# EAGLE design IMU 9DoF AHRS (EAGLE 7.0.0)

## Sheet 1 of 2
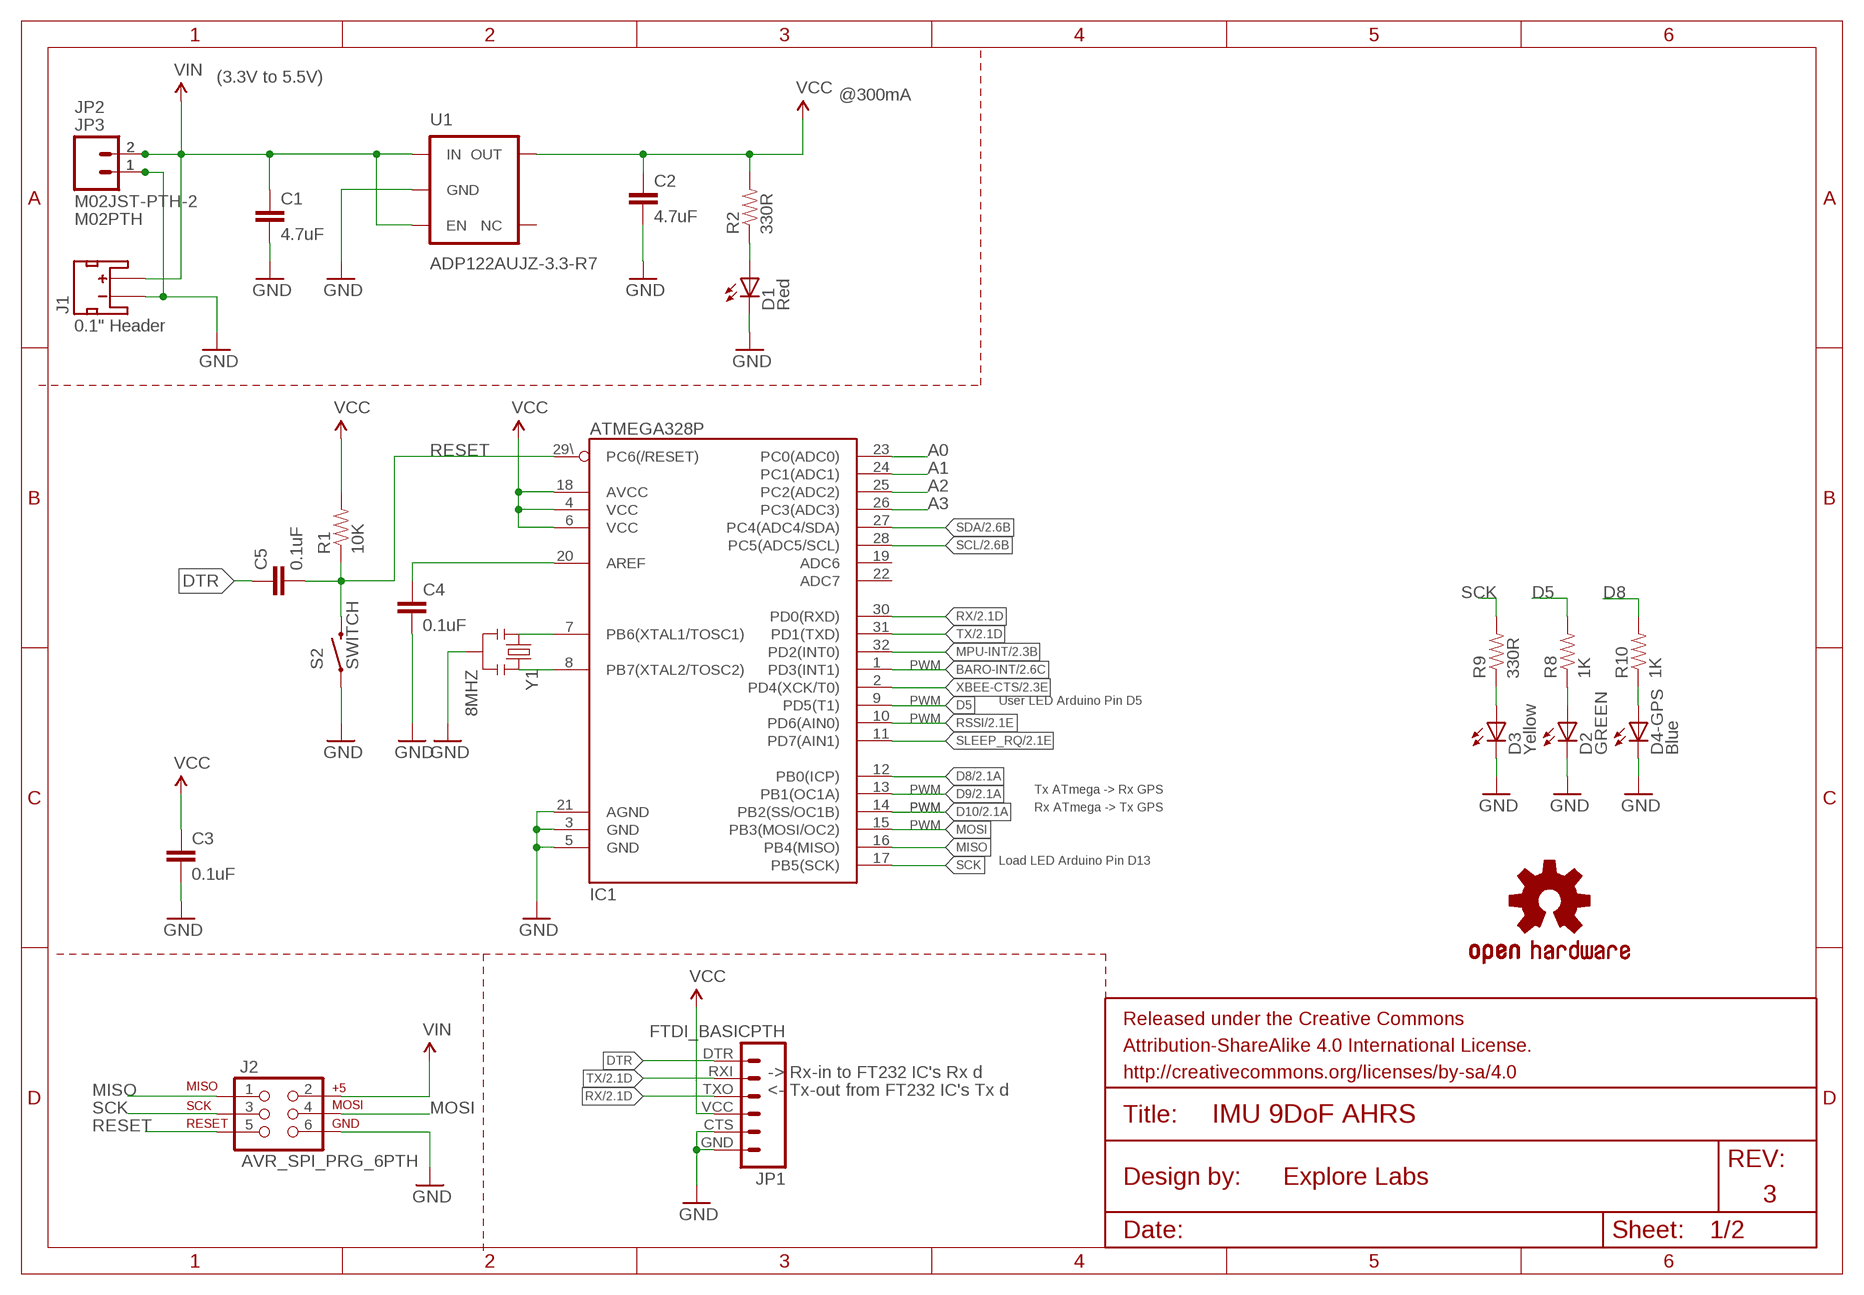
[diagram p0: schematic, sheet 1]

### Parts
C1  4.7uF  CAP0603-CAP  [0603-CAP]
C2  4.7uF  CAP0603-CAP  [0603-CAP]
C3  0.1uF  CAP0603-CAP  [0603-CAP]
C4  0.1uF  CAP0603-CAP  [0603-CAP]
C5  0.1uF  CAP0603-CAP  [0603-CAP]
D1  Red  LEDCHIPLED_0805  [CHIPLED_0805]
D2  GREEN  LEDCHIPLED_0805  [CHIPLED_0805]
D3  Yellow  LEDCHIPLED_0805  [CHIPLED_0805]
D4-GPS  Blue  LEDCHIPLED_0805  [CHIPLED_0805]
IC1  ATMEGA328P  ATMEGA328_SMT  [TQFP32-08]
J1  JST_2MM_MALE  [JST-2-SMD]
J2  AVR_SPI_PRG_6PTH  [2X3]
JP1  FTDI_BASICPTH  [FTDI_BASIC]
JP2  M02JST-PTH-2  [JST-2-PTH]
JP3  M02PTH  [1X02]
LOGO4  OSHW-LOGOBOTTOM  [OSHW-LOGO-M-BOTTOM]
R1  10K  RESISTOR0603-RES  [0603-RES]
R2  330R  RESISTOR0603-RES  [0603-RES]
R8  1K  RESISTOR0603-RES  [0603-RES]
R9  330R  RESISTOR0603-RES  [0603-RES]
R10  1K  RESISTOR0603-RES  [0603-RES]
S2  SWITCH-MOMENTARY-2-SMD-1101NE  [TACTILE-SWITCH-1101NE]
U1  ADP122AUJZ-3.3-R7  [SOT-23-5]
Y1  8MHZ  RESONATOR8MHZ  [RESONATOR-SMD]

### Nets
A0: IC1.23(PC0(ADC0))
A1: IC1.24(PC1(ADC1))
A2: IC1.25(PC2(ADC2))
A3: IC1.26(PC3(ADC3))
BARO-INT: IC1.1(PD3(INT1)) ; also sheet 2
D5: IC1.9(PD5(T1)) R8.2
D8: IC1.12(PB0(ICP)) R10.2 ; also sheet 2
D9: IC1.13(PB1(OC1A)) ; also sheet 2
D10: IC1.14(PB2(SS/OC1B)) ; also sheet 2
DTR: C5.1 JP1.DTR
GND: C1.2 C2.2 C3.2 C4.2 D1.C D2.C D3.C D4-GPS.C IC1.3(GND) IC1.5(GND) IC1.21(AGND) J1.1(-) J2.6 JP1.CTS JP1.GND JP2.1 JP3.1 S2.P$1 U1.2(GND) Y1.2 ; also sheet 2
MISO: IC1.16(PB4(MISO)) J2.1
MOSI: IC1.15(PB3(MOSI/OC2)) J2.4
MPU-INT: IC1.32(PD2(INT0)) ; also sheet 2
N$2: IC1.8(PB7(XTAL2/TOSC2)) Y1.3
N$3: IC1.7(PB6(XTAL1/TOSC1)) Y1.1
N$4: D3.A R9.1
N$5: C4.1 IC1.20(AREF)
N$7: D2.A R8.1
N$8: D1.A R2.1
N$11: D4-GPS.A R10.1
RESET: C5.2 IC1.29\(PC6(/RESET)) J2.5 R1.1 S2.P$2
RSSI: IC1.10(PD6(AIN0)) ; also sheet 2
RX: IC1.30(PD0(RXD)) JP1.TXO ; also sheet 2
SCK: IC1.17(PB5(SCK)) J2.3 R9.2
SCL: IC1.28(PC5(ADC5/SCL)) ; also sheet 2
SDA: IC1.27(PC4(ADC4/SDA)) ; also sheet 2
SLEEP_RQ: IC1.11(PD7(AIN1)) ; also sheet 2
TX: IC1.31(PD1(TXD)) JP1.RXI ; also sheet 2
VCC: C2.1 C3.1 IC1.4(VCC) IC1.6(VCC) IC1.18(AVCC) JP1.VCC R1.2 R2.2 U1.5(OUT) ; also sheet 2
VIN: C1.1 J1.2(+) J2.2 JP2.2 JP3.2 U1.1(IN) U1.3(EN) ; also sheet 2
XBEE-CTS: IC1.2(PD4(XCK/T0)) ; also sheet 2
Unconnected: IC1.19(ADC6) IC1.22(ADC7) J1.NC1(PAD1) J1.NC2(PAD2) U1.4(NC)

### Notes on the sheet
- (3.3V to 5.5V)
- @300mA
- 0.1" Header
- SWITCH | PWM
- PWM | User LED Arduino Pin D5
- PWM
- PWM | Tx ATmega -> Rx GPS
- PWM | PWM | Rx ATmega -> Tx GPS
- PWM
- Load LED Arduino Pin D13
- -> Rx-in to FT232 IC's Rx d
- <- Tx-out from FT232 IC's Tx d
- 3

## Sheet 2 of 2
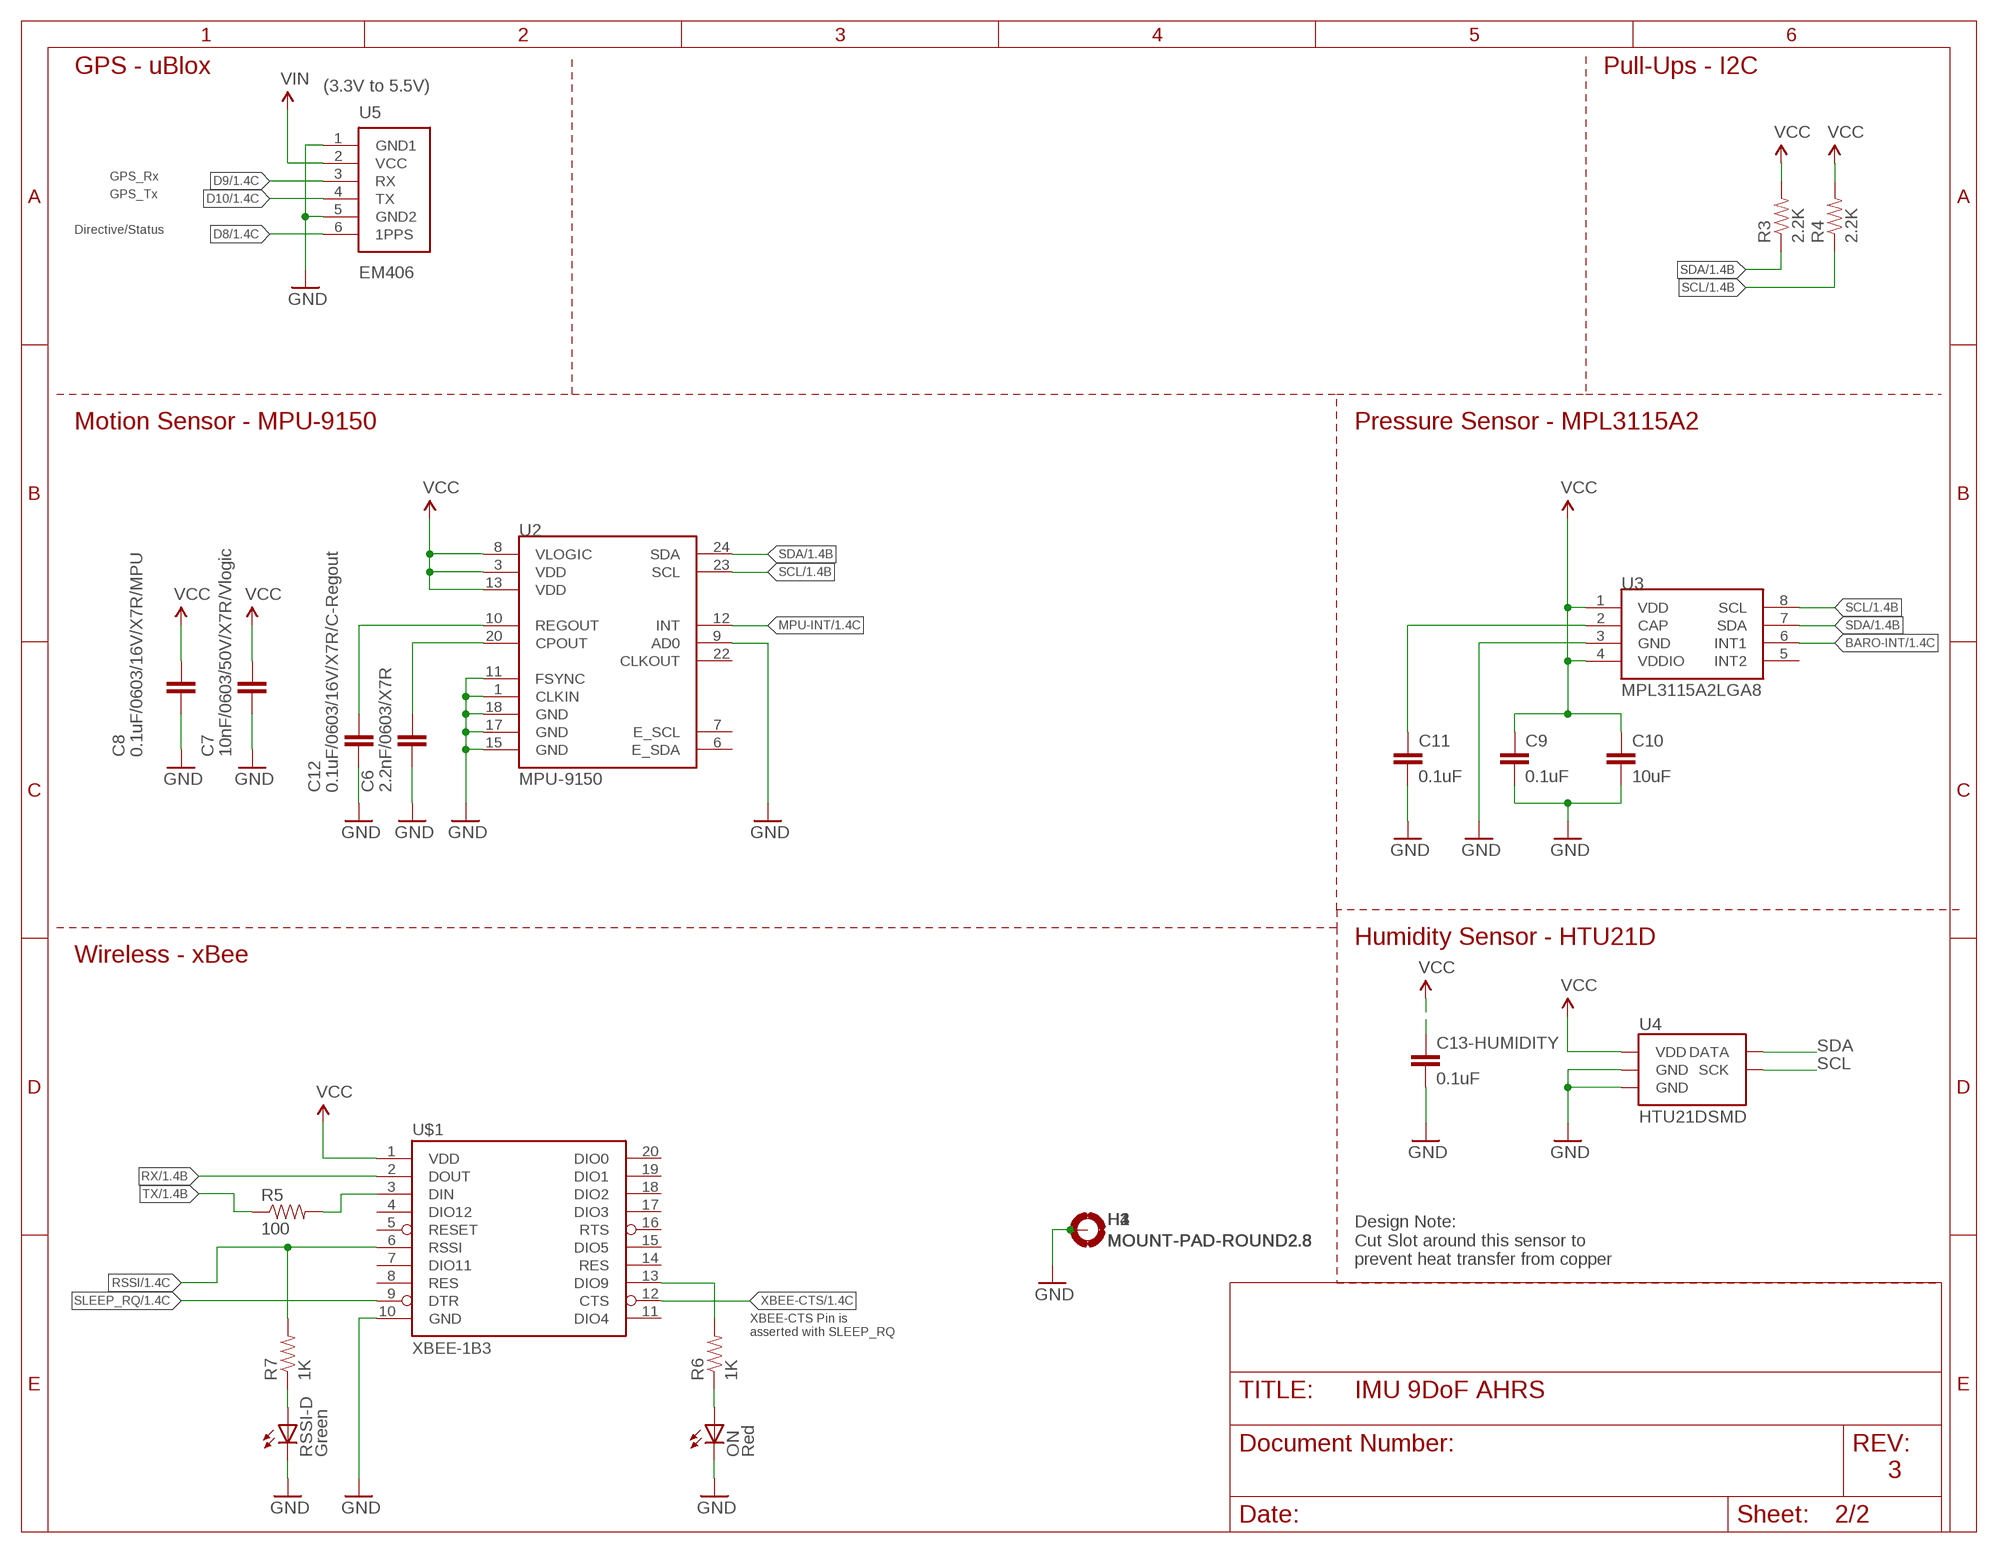
[diagram p1: schematic, sheet 2]

### Parts
C6  2.2nF/0603/X7R  CAP0603-CAP  [0603-CAP]
C7  10nF/0603/50V/X7R/Vlogic  CAP0603-CAP  [0603-CAP]
C8  0.1uF/0603/16V/X7R/MPU  CAP0603-CAP  [0603-CAP]
C9  0.1uF  CAP0603-CAP  [0603-CAP]
C10  10uF  CAP0805  [0805]
C11  0.1uF  CAP0603-CAP  [0603-CAP]
C12  0.1uF/0603/16V/X7R/C-Regout  CAP0603-CAP  [0603-CAP]
C13-HUMIDITY  0.1uF  CAP0603-CAP  [0603-CAP]
H1  MOUNT-PAD-ROUND2.8  [2,8-PAD]
H2  MOUNT-PAD-ROUND2.8  [2,8-PAD]
H3  MOUNT-PAD-ROUND2.8  [2,8-PAD]
H4  MOUNT-PAD-ROUND2.8  [2,8-PAD]
ON  Red  LEDCHIPLED_0805  [CHIPLED_0805]
R3  2.2K  RESISTOR0603-RES  [0603-RES]
R4  2.2K  RESISTOR0603-RES  [0603-RES]
R5  100  RESISTOR0603-RES  [0603-RES]
R6  1K  RESISTOR0603-RES  [0603-RES]
R7  1K  RESISTOR0603-RES  [0603-RES]
RSSI-D  Green  LEDCHIPLED_0805  [CHIPLED_0805]
U2  MPU-9150QFN-24-NP  [QFN-24-NP]
U3  MPL3115A2LGA8  [LGA8]
U4  HTU21DSMD  [HTU21D]
U5  EM406  [EM406]
U$1  XBEE-1B3  [XBEE-SMD]

### Nets
BARO-INT: U3.6(INT1) ; also sheet 1
D8: U5.6(1PPS) ; also sheet 1
D9: U5.3(RX) ; also sheet 1
D10: U5.4(TX) ; also sheet 1
GND: C6.2 C7.2 C8.2 C9.2 C10.2 C11.2 C12.2 C13-HUMIDITY.2 H1.B2,8(MOUNT) H2.B2,8(MOUNT) H3.B2,8(MOUNT) H4.B2,8(MOUNT) ON.C RSSI-D.C U2.1(CLKIN) U2.9(AD0) U2.11(FSYNC) U2.15(GND) U2.17(GND) U2.18(GND) U3.3(GND) U4.7(GND) U4.GND U5.1(GND1) U5.5(GND2) U$1.10(GND) ; also sheet 1
MPU-INT: U2.12(INT) ; also sheet 1
N$1: C6.1 U2.20(CPOUT)
N$6: R5.2 U$1.3(DIN)
N$10: R7.1 RSSI-D.A
N$12: R6.2 U$1.13(DIO9)
N$13: C12.1 U2.10(REGOUT)
N$14: ON.A R6.1
N$22: C11.1 U3.2(CAP)
RSSI: R7.2 U$1.6(RSSI) ; also sheet 1
RX: U$1.2(DOUT) ; also sheet 1
SCL: R4.1 U2.23(SCL) U3.8(SCL) U4.SCK ; also sheet 1
SDA: R3.1 U2.24(SDA) U3.7(SDA) U4.DATA ; also sheet 1
SLEEP_RQ: U$1.9(DTR) ; also sheet 1
TX: R5.1 ; also sheet 1
VCC: C7.1 C8.1 C9.1 C10.1 C13-HUMIDITY.1 R3.2 R4.2 U2.3(VDD) U2.8(VLOGIC) U2.13(VDD) U3.1(VDD) U3.4(VDDIO) U4.VDD U$1.1(VDD) ; also sheet 1
VIN: U5.2(VCC) ; also sheet 1
XBEE-CTS: U$1.12(CTS) ; also sheet 1
Unconnected: U2.6(E_SDA) U2.7(E_SCL) U2.22(CLKOUT) U3.5(INT2) U$1.4(DIO12) U$1.5(RESET) U$1.7(DIO11) U$1.8(RES) U$1.11(DIO4) U$1.14(RES) U$1.15(DIO5) U$1.16(RTS) U$1.17(DIO3) U$1.18(DIO2) U$1.19(DIO1) U$1.20(DIO0)

### Notes on the sheet
- GPS - uBlox | Pull-Ups - I2C
- (3.3V to 5.5V)
- GPS_Rx
- GPS_Tx
- Directive/Status
- Motion Sensor - MPU-9150 | Pressure Sensor - MPL3115A2
- MPU-9150
- Humidity Sensor - HTU21D
- Wireless - xBee
- Design Note:
  Cut Slot around this sensor to
  prevent heat transfer from copper
- XBEE-CTS Pin is
  asserted with SLEEP_RQ
- 3

## Library data of the parts
C1-C8 C12 = SparkFun-Passives:CAP: Capacitor Standard 0603 ceramic capacitor, and 0.1" leaded capacitor.
C9-C11 C13-HUMIDITY = SparkFun-Capacitors:CAP: Capacitor Standard 0603 ceramic capacitor, and 0.1" leaded capacitor.
D1-D3 D4-GPS ON RSSI-D = adafruit:LED: LED OSRAM: - CHIPLED LG R971, LG N971, LY N971, LG Q971, LY Q971, LO R971, LY R971 LH N974, LH R974 LS Q976, LO Q976, LY Q976 LO Q996 - Hyper CHIPLED LW Q18S LB Q993, LB Q99A, LB R99A - SideLED LS A670, LO A670, LY A670, LG A670, LP A670 LB A673, LV A673, LT A673, LW A673 LH A674 LY A675 LS A676, LA A676, LO A676, LY A676, LW A676 LS A679, LY A679, LG A679 - Hyper Micro SIDELED® LS Y876, LA Y876, LO Y876, LY Y876 LT Y87S - SmartLED LW L88C, LW L88S LB L89C, LB L89S, LG L890 LS L89K, LO L89K, LY L89K LS L896, LA L896, LO L896, LY L896 - TOPLED LS T670, LO T670, LY T670, LG T670, LP T670 LSG T670, LSP T670, LSY T670, LOP T670, LYG T670 LG T671, LOG T671, LSG T671 LB T673, LV T673, LT T673, LW T673 LH T674 LS T676, LA T676, LO T676, LY T676, LB T676, LH T676, LSB T676, LW T676 LB T67C, LV T67C, LT T67C, LS T67K, LO T67K, LY T67K, LW E67C LS E67B, LA E67B, LO E67B, LY E67B, LB E67C, LV E67C, LT E67C LW T67C LS T679, LY T679, LG T679 LS T770, LO T770, LY T770, LG T770, LP T770 LB T773, LV T773, LT T773, LW T773 LH T774 LS E675, LA E675, LY E675, LS T675 LS T776, LA T776, LO T776, LY T776, LB T776 LHGB T686 LT T68C, LB T68C - Hyper Mini TOPLED® LB M676 - Mini TOPLED Santana® LG M470 LS M47K, LO M47K, LY M47K Source: http://www.osram.convergy.de/
H1-H4 = holes:MOUNT-PAD-ROUND: MOUNTING PAD, round
IC1 = 11xLabs:ATMEGA328_SMT: 32-Pin Atmega328 part Commonly used on Arduino compatible boards Available in QFP and QFN packages TQFP is IC-09069 QFN is non-stock; PROD_ID: IC-09069
J1 = SparkFun-Connectors:JST_2MM_MALE: Mates to single-cell LiPo batteries. CONN-08352; PROD_ID: CONN-08352
J2 = SparkFun-Connectors:AVR_SPI_PRG_6: AVR ISP 6 Pin This is the reduced ISP connector for AVR programming. Common on Arduino. This footprint will take up less PCB space and can be used with a 10-pin to 6-pin adapter such as SKU: BOB-08508
JP1 = SparkFun-Connectors:FTDI_BASIC: FTDI Basic header with labels
JP2 = SparkFun-Connectors:M02: Standard 2-pin 0.1" header. Use with - straight break away headers ( PRT-00116) - right angle break away headers (PRT-00553) - swiss pins (PRT-00743) - machine pins (PRT-00117) - female headers (PRT-00115) Molex polarized connector foot print use with: PRT-08233 with associated crimp pins and housings. 2.54_SCREWTERM for use with PRT-10571. 3.5mm Screw Terminal footprints for PRT-08084 5mm Screw Terminal footprints for use with PRT-08433; SKU: PRT-09914
JP3 = SparkFun-Connectors:M02: Standard 2-pin 0.1" header. Use with - straight break away headers ( PRT-00116) - right angle break away headers (PRT-00553) - swiss pins (PRT-00743) - machine pins (PRT-00117) - female headers (PRT-00115) Molex polarized connector foot print use with: PRT-08233 with associated crimp pins and housings. 2.54_SCREWTERM for use with PRT-10571. 3.5mm Screw Terminal footprints for PRT-08084 5mm Screw Terminal footprints for use with PRT-08433
LOGO4 = 11xLabs:OSHW-LOGO: Open Source Hardware Logo This logo indicates the piece of hardware it is found on incorporates a OSHW license and/or adheres to the definition of open source hardware found here: http://freedomdefined.org/OSHW
R1-R10 = SparkFun-Passives:RESISTOR: Resistor Basic schematic elements and footprints for 0603, 1206, and PTH resistors.
S2 = SparkFun-Electromechanical:SWITCH-MOMENTARY-2: Various NO switches- pushbuttons, reed, etc
U1 = 11xLabs:ADP122
U2 = 11xLabs:MPU-9150: 9DOF (3mag, 3accel, 3rotat). I2C interface.
U3 = 11xLabs:MPL3115A2: Altimeter/Pressure Sensor, I2C, 1.95V-3.6V supply, 50 to 110kPa
U4 = 11xLabs:HTU21D
U5 = 11xLabs:EM406: EM406 GPS Connector Proven layout and schematic for EM406 connector. Spark Fun Electronics SKU : GPS-00579
U$1 = SparkFun-RF:XBEE-1: Xbee module footprints SMT header is CONN-09042.; PROD_ID: CONN-09042
Y1 = 11xLabs:RESONATOR: Resonator Small SMD resonator. Used, eg, on the Arduino Pro/ Pro Mini boards. 8MHz- XTAL-08895 16MHz- XTAL-08900; PROD_ID: XTAL-08895

## Board
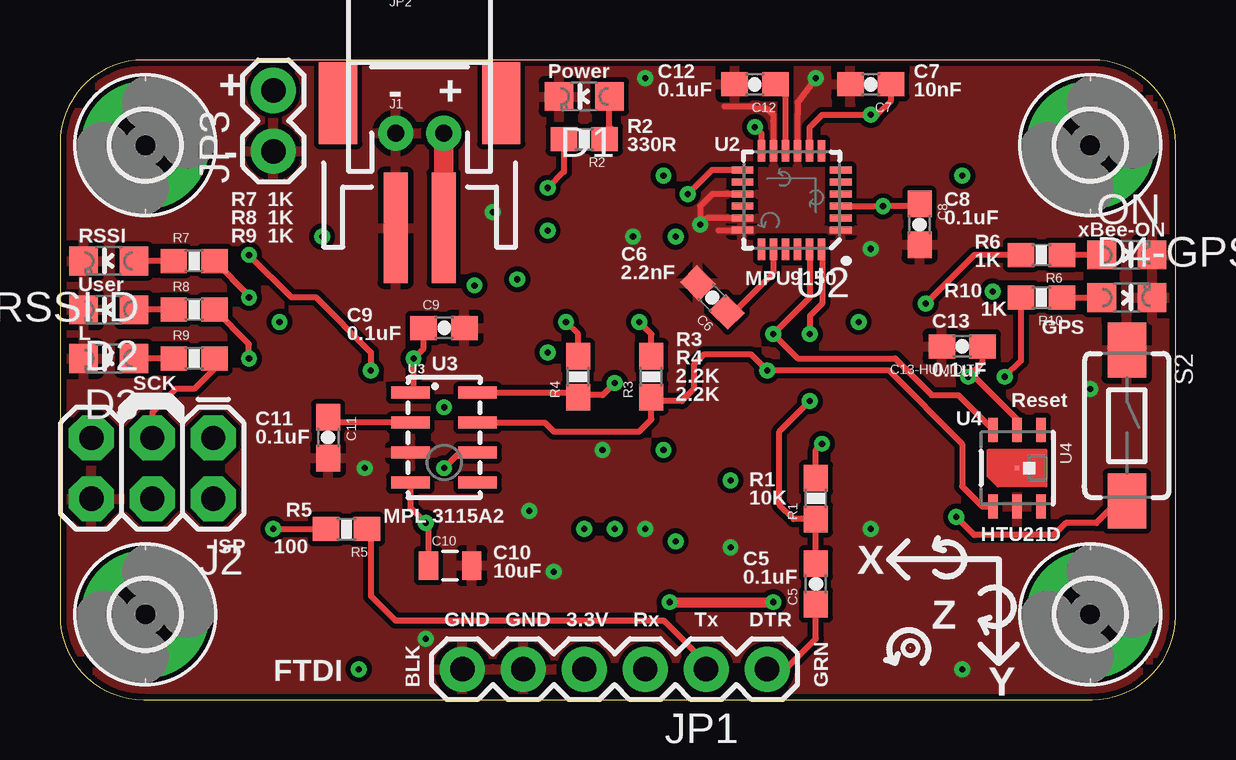
[diagram p2: board, top side]
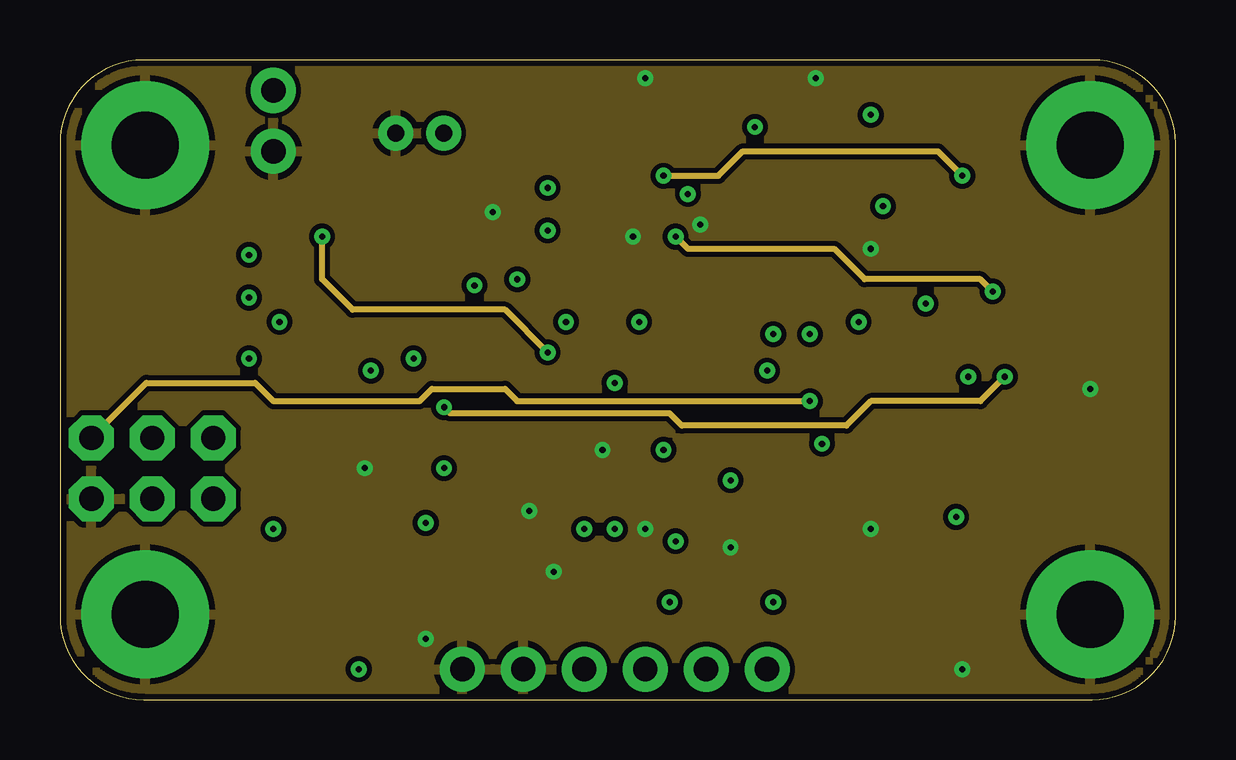
[diagram p3: board, inner layer $GND]
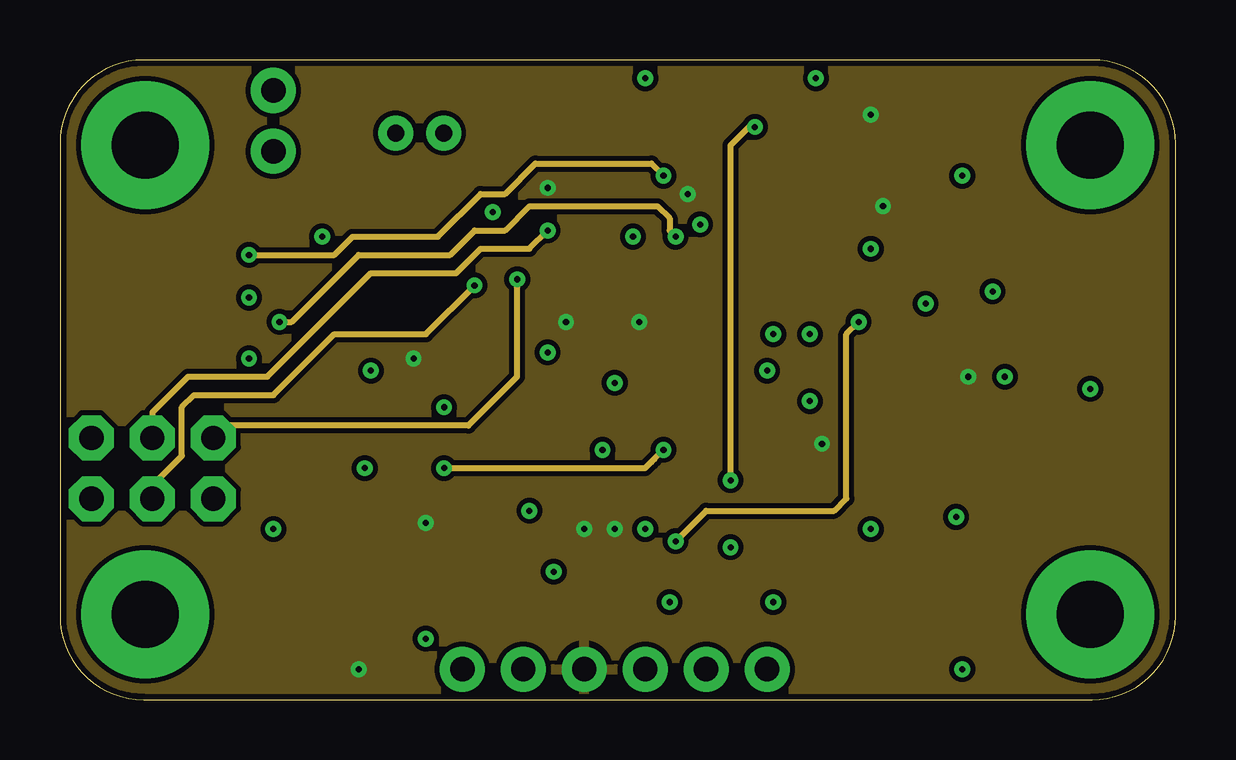
[diagram p4: board, inner layer $VCC]
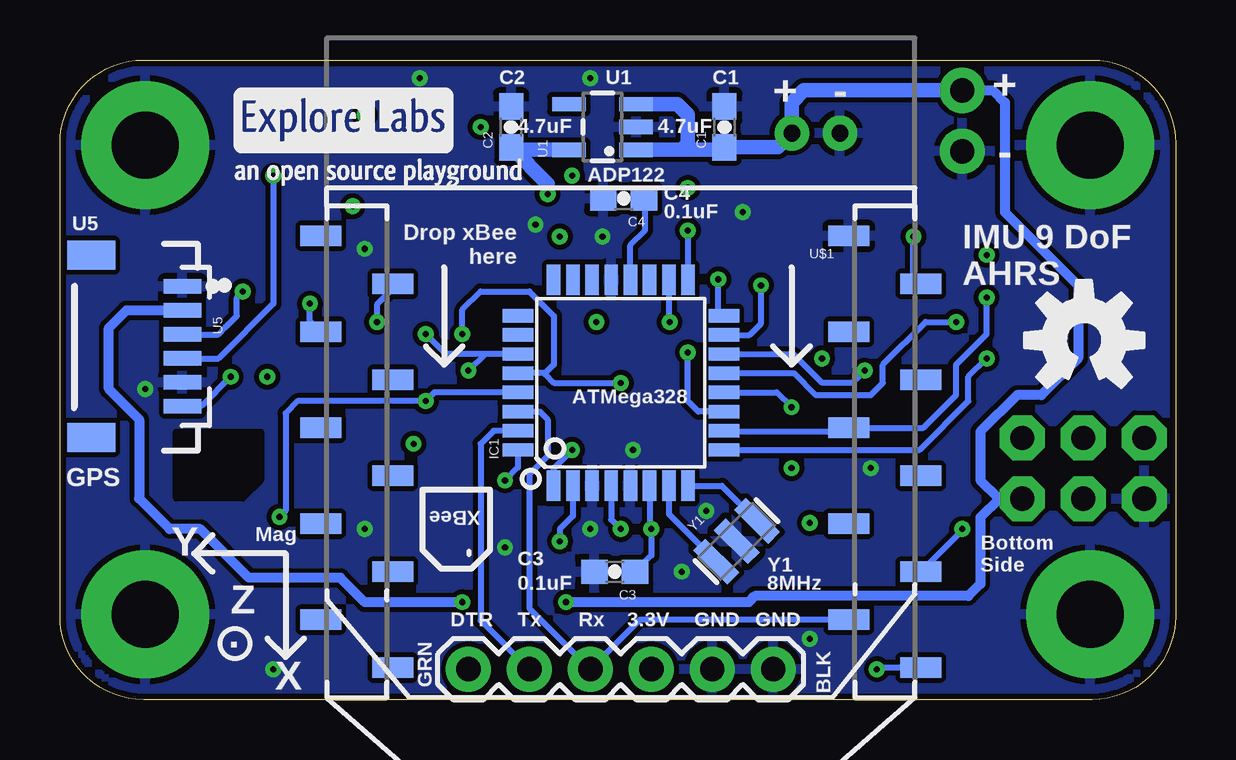
[diagram p5: board, bottom side, seen from below]

Size 46.48 x 26.67 mm. Coordinates in mm from the lower left corner, seen from the top.
Outline: 46.48,3.48 46.48,23.19 arc90 43,26.67 3.48,26.67 arc90 0,23.19 0,3.48 arc90 3.48,0 43,0 arc90 46.48,3.48
Copper layers (1+2*15+16): Top 0.035mm / dielectric 8mil / $GND 0.035mm / dielectric 40mil / $VCC 0.035mm / dielectric 8mil / Bottom 0.035mm
Design rules "Explore Labs 4 Layer dru": minimum track width 10mil, minimum drill 10mil, track to track 8mil, track to pad 8mil, pad to pad 8mil, via to via 8mil, smd to smd 8mil, copper to edge 10mil, drill to drill 8mil, minimum pad ring 10mil, minimum via ring 8mil, stop-mask expansion 4mil, vias tented up to drill 18mil, thermal gap 10mil
bRestrict: area 38.1,8.4 to 41.7,11.2

### Footprints (pad centres in the part's own frame; a part is rotated, then mirrored left to right if it is on the bottom)
0603-CAP = smd 1.1 x 1: 1 -0.85,0; 2 0.85,0
0805 = smd 0.8 x 1.2: 1 -0.9,0; 2 0.9,0
CHIPLED_0805 = smd 1.2 x 1.2: A 0,-1.05; C 0,1.05
2,8-PAD = drill 2.8 pad 5.334: B2,8 0,0
TQFP32-08 = smd 1.27 x 0.559: 1 -4.293,2.8; 2 -4.293,2; 3 -4.293,1.2; 4 -4.293,0.4; 5 -4.293,-0.4; 6 -4.293,-1.2; 7 -4.293,-2; 8 -4.293,-2.8; 17 4.293,-2.8; 18 4.293,-2; 19 4.293,-1.2; 20 4.293,-0.4; 21 4.293,0.4; 22 4.293,1.2; 23 4.293,2; 24 4.293,2.8 | smd 0.559 x 1.27: 9 -2.8,-4.293; 10 -2,-4.293; 11 -1.2,-4.293; 12 -0.4,-4.293; 13 0.4,-4.293; 14 1.2,-4.293; 15 2,-4.293; 16 2.8,-4.293; 25 2.8,4.293; 26 2,4.293; 27 1.2,4.293; 28 0.4,4.293; 29\ -0.4,4.293; 30 -1.2,4.293; 31 -2,4.293; 32 -2.8,4.293
JST-2-SMD = smd 1 x 4.6: 1 -1,-3.7; 2 1,-3.7 | smd 1.6 x 3.4: NC1 -3.4,1.5; NC2 3.4,1.5
2X3 = drill 1.016 pad 1.88 octagon: 1 0,0; 2 0,2.54; 3 2.54,0; 4 2.54,2.54; 5 5.08,0; 6 5.08,2.54
FTDI_BASIC = drill 1.016 pad 1.88: CTS 10.16,0; DTR 0,0; GND 12.7,0; RXI 2.54,0; TXO 5.08,0; VCC 7.62,0
JST-2-PTH = drill 0.7 pad 1.448: 1 -1,0; 2 1,0
1X02 = drill 1.016 pad 1.88: 1 0,0; 2 2.54,0
0603-RES = smd 1.1 x 1: 1 -0.85,0; 2 0.85,0
TACTILE-SWITCH-1101NE = smd 2.3 x 1.6: P$1 -3.15,0; P$2 3.15,0
SOT-23-5 = smd 0.6 x 1.4: 1 -0.95,-1.4; 2 0,-1.4; 3 0.95,-1.4; 4 0.95,1.4; 5 -0.95,1.4
QFN-24-NP = smd 0.9 x 0.3: 1 -2.05,1.25; 2 -2.05,0.75; 3 -2.05,0.25; 4 -2.05,-0.25; 5 -2.05,-0.75; 6 -2.05,-1.25; 13 2.05,-1.25; 14 2.05,-0.75; 15 2.05,-0.25; 16 2.05,0.25; 17 2.05,0.75; 18 2.05,1.25 | smd 0.3 x 0.9: 7 -1.25,-2.05; 8 -0.75,-2.05; 9 -0.25,-2.05; 10 0.25,-2.05; 11 0.75,-2.05; 12 1.25,-2.05; 19 1.25,2.05; 20 0.75,2.05; 21 0.25,2.05; 22 -0.25,2.05; 23 -0.75,2.05; 24 -1.25,2.05
LGA8 = smd 1.6 x 0.5: 1 -1.4,1.875; 2 -1.4,0.625; 3 -1.4,-0.625; 4 -1.4,-1.875; 5 1.4,-1.875; 6 1.4,-0.625; 7 1.4,0.625; 8 1.4,1.875
HTU21D = smd 0.2 x 0.2: 7 0,0 | smd 1 x 0.4: DATA 1.6,-1; GND 1.6,0; NC@1 -1.6,1; NC@6 1.6,1; SCK -1.6,-1; VDD -1.6,0
EM406 = smd 0.6 x 1.55: 1 -2.5,1.8; 2 -1.5,1.8; 3 -0.5,1.8; 4 0.5,1.8; 5 1.5,1.8; 6 2.5,1.8 | smd 1.2 x 2: P$1 -3.8,-2; P$2 3.8,-2
XBEE-SMD = smd 1.7 x 0.85: 1 -12.5,20; 2 -9.5,18; 3 -12.5,16; 4 -9.5,14; 5 -12.5,12; 6 -9.5,10; 7 -12.5,8; 8 -9.5,6; 9 -12.5,4; 10 -9.5,2; 11 12.5,2; 12 9.5,4; 13 12.5,6; 14 9.5,8; 15 12.5,10; 16 9.5,12; 17 12.5,14; 18 9.5,16; 19 12.5,18; 20 9.5,20
RESONATOR-SMD = smd 0.7 x 2: 1 -1.2,0; 2 0,0; 3 1.2,0

### Placement (x,y rotation side)
C1  18.8,23.88 90 bottom
C2  27.69,23.88 90 bottom
C3  23.37,5.33 180 bottom
C4  23,20.89 180 bottom
C5  31.5,4.83 90 top
C6  27.18,16.76 135 top
C7  33.78,25.65 180 top
C8  35.81,19.81 270 top
C9  16,15.49 0 top
C10  16.26,5.59 0 top
C11  11.18,10.92 270 top
C12  28.96,25.65 180 top
C13-HUMIDITY  37.59,14.73 180 top
D1  21.84,25.15 90 top
D2  2.03,16.26 90 top
D3  2.03,14.22 90 top
D4-GPS  44.45,16.76 270 top
H1  3.56,23.11 0 top
H2  42.93,23.11 0 top
H3  3.56,3.56 0 top
H4  42.93,3.56 0 top
IC1  23.11,13.21 90 bottom
J1  14.99,23.37 0 top
J2  6.39,10.91 180 top
JP1  29.46,1.27 180 top
JP2  14.99,23.62 0 top
JP3  8.89,22.86 90 top
LOGO4  3.81,14.99 0 top
ON  44.45,18.54 270 top
R1  31.5,8.38 90 top
R2  21.84,23.37 180 top
R3  24.64,13.46 90 top
R4  21.59,13.46 90 top
R5  11.94,7.11 180 top
R6  40.89,18.54 180 top
R7  5.59,18.29 0 top
R8  5.59,16.26 0 top
R9  5.59,14.22 0 top
R10  40.89,16.76 180 top
RSSI-D  2.03,18.29 90 top
S2  44.45,11.43 270 top
U1  23.88,23.88 90 bottom
U2  30.48,20.83 180 top
U3  16,10.92 0 top
U4  39.88,9.65 270 top
U5  43.18,14.73 270 bottom
U$1  23.11,21.34 180 bottom
U$3  [EXLABS_LOGO_0.25]  39.62,20.57 0 bottom
Y1  18.29,6.6 45 bottom

### Tracks (layer width: path | path; a pad name or v marks a point on that pad's centre or on a via)
BARO-INT  (via drill 0.25)
  Top 0.254: v16,9.65 16.65,10.3 U3.6
  $VCC 0.254: v25.15,10.41 24.77,10.03 24.64,9.91 24.38,9.65 v16,9.65
  Bottom 0.254: IC1.1 25.91,9.65 v25.15,10.41
D5  (via drill 0.25)
  Top 0.254: v7.87,14.22 7.87,14.82 R8.2
  Bottom 0.254: IC1.9 10.67,10.41 8.64,12.45 8.64,13.46 v7.87,14.22
D8  (via drill 0.25)
  Top 0.254: v39.37,13.46 40.04,14.14 R10.2
  $GND 0.254: v16,12.19 16.26,11.94 25.4,11.94 25.91,11.43 32.77,11.43 33.78,12.45 38.35,12.45 v39.37,13.46
  Bottom 0.254: IC1.12 16.62,12.81 v16,12.19 | U5.6 40.56,12.27 v39.37,13.46
D9  (via drill 0.25)
  $GND 0.254: v25.65,19.3 26.16,18.8 32.26,18.8 33.53,17.53 38.35,17.53 v38.86,17.02
  $VCC 0.254: v9.14,15.75 9.65,15.75 12.45,18.54 16.26,18.54 17.27,19.56 18.54,19.56 19.56,20.57 24.89,20.57 25.4,20.07 25.4,19.56 v25.65,19.3
  Bottom 0.254: IC1.13 15.89,13.61 14.99,12.7 12.7,12.7 12.19,13.21 12.19,13.97 10.41,15.75 v9.14,15.75 | v38.86,17.02 39.12,16.76 39.12,16 39.5,15.62 39.59,15.53 39.89,15.23 U5.3
D10  (via drill 0.25)
  Top 0.254: v12.95,13.72 12.95,14.48 10.67,16.76 9.65,16.76 v7.87,18.54
  $GND 0.254: v25.15,21.84 27.43,21.84 28.45,22.86 36.58,22.86 v37.59,21.84
  $VCC 0.254: v7.87,18.54 11.43,18.54 12.19,19.3 15.75,19.3 17.53,21.08 18.54,21.08 19.81,22.35 24.64,22.35 v25.15,21.84
  Bottom 0.254: IC1.14 15.93,14.41 14.73,13.21 13.46,13.21 v12.95,13.72 | v37.59,21.84 37.59,16.51 39.87,14.23 U5.4
DTR
  Top 0.254: JP1.DTR 30.23,1.27 31.5,2.54 C5.1
GND  (via drill 0.25)
  Top 0.254: U2.9 30.73,24.38 30.73,24.89 v31.5,25.91 | U2.17 28.37,20.07 26.92,20.07 v26.67,19.81 26.67,20.57 27.18,21.08 28.38,21.08 U2.15 | 27.43,19.56 28.37,19.56 28.38,19.57 U2.18 | 29.72,24.13 29.73,24.12 U2.11 29.73,24.37 29.46,24.64 28.96,24.64 28.87,24.73 C2.2
  other vias: 23.88,19.3 24.38,7.11 15.24,2.54 24.38,25.91 33.78,18.8 18.03,20.32 12.7,9.65 27.94,6.35 22.61,10.41 19.56,7.87 33.78,7.11 42.93,12.95 37.59,1.27 20.57,5.33
  pour Top: 0,0 51.82,0 51.82,33.53 0,33.53
  pour $GND: 0,0 55.88,0 55.88,36.83 0,36.83
  pour Bottom: 0,0 65.28,0 65.28,43.18 0,43.18
MISO  (via drill 0.25)
  $VCC 0.254: v19.05,17.53 19.05,13.46 17.02,11.43 6.9,11.43 J2.1
  Bottom 0.254: IC1.16 19.05,16.24 v19.05,17.53
MOSI  (via drill 0.25)
  $VCC 0.254: J2.4 3.85,8.93 5.08,10.16 5.08,12.19 5.59,12.7 8.89,12.7 11.43,15.24 15.24,15.24 v17.27,17.27
  Bottom 0.254: IC1.15 17.75,15.21 17.27,15.68 v17.27,17.27
MPU-INT  (via drill 0.25)
  Top 0.254: U2.12 29.23,23.6 v28.96,23.88
  $VCC 0.254: v27.94,9.14 27.94,23.11 28.7,23.88 v28.96,23.88
  Bottom 0.254: IC1.32 27.41,9.68 v27.94,9.14
N$1
  Top 0.254: U2.20 29.72,18.72 29.72,17.78 28.1,16.16 C6.1
N$2
  Bottom 0.254: IC1.8 18.9,8.91 Y1.3
N$3
  Bottom 0.254: IC1.7 21.11,7.73 Y1.1
N$4
  Top 0.254: R9.1 D3.A
N$5
  Bottom 0.254: IC1.20 22.71,18.94 22.1,19.56 22.1,20.84 C4.1
N$6  (via drill 0.25)
  Top 0.254: v8.89,7.11 R5.2
  Bottom 0.254: U$1.3 8.89,7.06 v8.89,7.11
N$7
  Top 0.254: R8.1 D2.A
N$8
  Top 0.254: 22.59,23.47 R2.1 | 22.89,23.77 D1.A
  Top 0.406: 22.59,23.47 22.89,23.77
N$10
  Top 0.254: R7.1 RSSI-D.A
N$11
  Top 0.254: R10.1 D4-GPS.A
N$12  (via drill 0.25)
  Top 0.254: v36.07,16.51 38.1,18.54 R6.2
  Bottom 0.254: U$1.13 36.07,15.79 v36.07,16.51
N$13
  Top 0.254: U2.10 30.23,25.23 C12.1
N$14
  Top 0.254: ON.A R6.1
N$22
  Top 0.254: U3.2 11.4,11.55 C11.1
RESET  (via drill 0.25)
  Top 0.254: C5.2 R1.1 30.57,7.53 29.97,8.13 29.97,11.18 v31.24,12.45 | 44.7,7.62 S2.P$2 44.09,8.28 43.18,7.37 41.91,7.37 41.4,6.86 38.1,6.86 v37.34,7.62
  $GND 0.254: J2.5 3.6,13.21 8.13,13.21 8.89,12.45 14.99,12.45 15.49,12.95 18.54,12.95 19.05,12.45 v31.24,12.45
  Bottom 0.254: IC1.29\ 30.88,12.81 v31.24,12.45 36.58,12.45 37.08,11.94 37.08,7.87 v37.34,7.62
RSSI  (via drill 0.25)
  Top 0.254: 6.1,18.29 R7.2 7.87,16.85 v7.87,16.76
  Bottom 0.254: U$1.6 13.74,11.21 | IC1.10 18.79,11.18 13.77,11.18 U$1.6 | U$1.6 10.51,11.34 9.14,12.7 9.14,13.97 7.87,15.24 v7.87,16.76
RX
  Bottom 0.254: IC1.30 26.49,12.01 26.16,11.68 26.16,10.16 26.92,9.4 26.92,3.81 JP1.TXO 22.32,3.34 U$1.2
SCK  (via drill 0.25)
  Top 0.254: J2.3 3.85,11.97 4.83,12.95 5.59,12.95 6.44,13.8 R9.2
  $VCC 0.254: v20.32,19.56 19.56,18.8 17.53,18.8 16.51,17.78 12.95,17.78 8.64,13.46 5.33,13.46 3.85,11.97 J2.3
  Bottom 0.254: v20.32,19.56 IC1.17
SCL  (via drill 0.25)
  Top 0.254: U2.23 31.24,18.72 31.24,16.76 v29.72,15.24 30.73,14.22 34.8,14.22 36.32,12.7 37.43,12.7 U4.SCK | U3.8 21.41,12.8 R4.1 21.68,12.7 22.61,12.7 v23.11,13.21
  Bottom 0.254: v29.72,15.24 29.72,16.26 28.96,17.02 26.92,17.02 25.91,16 25.91,13.97 26.27,13.61 | 26.27,13.61 IC1.28 | 26.27,13.61 26.27,13.57 25.91,13.21 v23.11,13.21
SDA  (via drill 0.25)
  Top 0.254: U2.24 31.75,18.71 31.75,16.51 31.24,16 v31.24,15.24 | U4.DATA 38.43,8.05 37.59,8.89 37.59,10.67 34.54,13.72 v29.46,13.72 28.77,14.41 26.85,14.41 26.42,13.97 26.42,12.95 25.91,12.45 24.8,12.45 R3.1 24.64,11.68 24.13,11.18 20.57,11.18 20.2,11.55 U3.7
  Bottom 0.254: v29.46,13.72 28.77,14.41 IC1.27 30.41,14.41 v31.24,15.24
SLEEP_RQ  (via drill 0.25)
  $GND 0.254: v20.32,14.48 18.54,16.26 12.19,16.26 10.92,17.53 v10.92,19.3
  Bottom 0.254: IC1.11 19.88,12.01 20.32,12.45 v20.32,14.48 | 10.55,17.27 U$1.9 10.92,17.64 v10.92,19.3
TX
  Top 0.254: R5.1 12.95,6.95 12.95,4.32 13.97,3.3 25.15,3.3 26.92,1.52 JP1.RXI
  Bottom 0.254: IC1.31 28.42,11.21 28.96,10.67 28.96,3.3 JP1.RXI
VCC  (via drill 0.25)
  Top 0.254: R2.2 20.99,22.01 v20.32,21.34 | U2.13 27.16,22.08 v26.16,21.08 | U2.8 31.23,23.86 31.75,24.38 v33.78,24.38 34.04,24.38 34.63,24.98 C7.1 | U2.3 32.58,20.57 v34.29,20.57 35.73,20.57 C8.1 | C9.1 15.15,14.64 v14.73,14.22 14.73,12.93 U3.1 | U3.4 14.6,8 v15.24,7.37 15.36,7.25 C10.1 | v31.75,10.67 31.5,10.41 R1.2 | v21.08,15.75 21.59,15.24 R4.2 | v24.13,15.75 24.64,15.24 R3.2 | U4.VDD 39.88,11.68 38.1,13.46 v37.85,13.46 38.44,14.06 C13-HUMIDITY.1
  Bottom 0.254: IC1.18 21.11,15.78 v21.08,15.75 | IC1.6 21.91,7.18 v21.84,7.11 21.84,6.01 C3.1 | U$1.1 12.38,1.34 v12.45,1.27 | IC1.4 23.51,7.51 v23.11,7.11
  Bottom 0.61: U1.5 27.59,22.93 C2.1 26.16,21.5 v26.16,21.08
  pour $VCC: 0,0 62.74,0 62.99,38.86 0,38.86
VIN  (via drill 0.25)
  Top 0.406: v25.4,4.06 v29.72,4.06
  Top 0.813: JP2.2 J1.2
  Bottom 0.406: JP3.2 7.62,25.4 7.11,24.89 7.11,20.32 4.06,17.27 4.06,14.22 5.59,12.7 6.6,12.7 8.13,11.18 8.13,9.14 7.36,8.37 | 7.36,8.37 8.13,7.6 8.13,4.83 8.64,4.32 17.53,4.32 17.78,4.06 v25.4,4.06 | v29.72,4.06 33.78,4.06 34.8,5.08 38.61,5.08 40.64,7.11 41.91,7.11 43.18,8.38 43.18,11.68 44.45,12.95 44.45,15.49 43.71,16.23 U5.2 | J2.2 7.36,8.37
  Bottom 0.61: U1.1 20.57,22.93 | 20.57,22.93 18.9,22.93 C1.1 16.58,23.03 JP2.2 16,23.64 16,24.89 15.49,25.4 JP3.2 | U1.3 20.76,24.83 20.32,24.38 20.32,23.18 20.57,22.93
XBEE-CTS  (via drill 0.25)
  $VCC 0.254: v25.65,6.6 26.92,7.87 32.26,7.87 32.77,8.38 32.77,15.24 v33.27,15.75
  Bottom 0.254: U$1.12 32.51,17.23 33.27,16.47 v33.27,15.75 | IC1.2 25.11,7.65 25.65,7.11 v25.65,6.6

### Text on the board
Measures: Miter - 137 | Miter - 137
Reference: take care of xBee antenna | do not place high speed signals under antenna
_tsilk: + | Power | C12 | C7 | - | + | 0.1uF | 10nF | R2 | - | 330R | U2 | R7 | 1K | C8 | R8 | 1K | 0.1uF | RSSI | R9 | 1K | R6 | xBee-ON | 2.2nF | C6 | 1K | User | MPU9150 | R10 | C9 | 1K | L | 0.1uF | R3 | C13 | GPS | U3 | R4 | SCK | 2.2K | 0.1uF | 2.2K | Reset | 0.1uF | C11 | U4 | R1 | R5 | 10K | MPL 3115A2 | HTU21D | ISP | 100 | C10 | C5 | X | 10uF | 0.1uF | Z | GND | GND | 3.3V | Rx | Tx | DTR | . | FTDI | BLK | GRN | Y
_bsilk: + | C1 | U1 | C2 | - | + | 4.7uF | 4.7uF | - | ADP122 | C4 | 0.1uF | Drop xBee / here | U5 | IMU 9 DoF | AHRS | ATMega328 | GPS | XBee | Mag | Y | C3 | Bottom / Side | 8MHz | Y1 | 0.1uF | Z | GND | GND | 3.3V | Rx | Tx | DTR | BLK | . | GRN | X